# EAGLE schematic MXRDist+ (EAGLE 6.4)
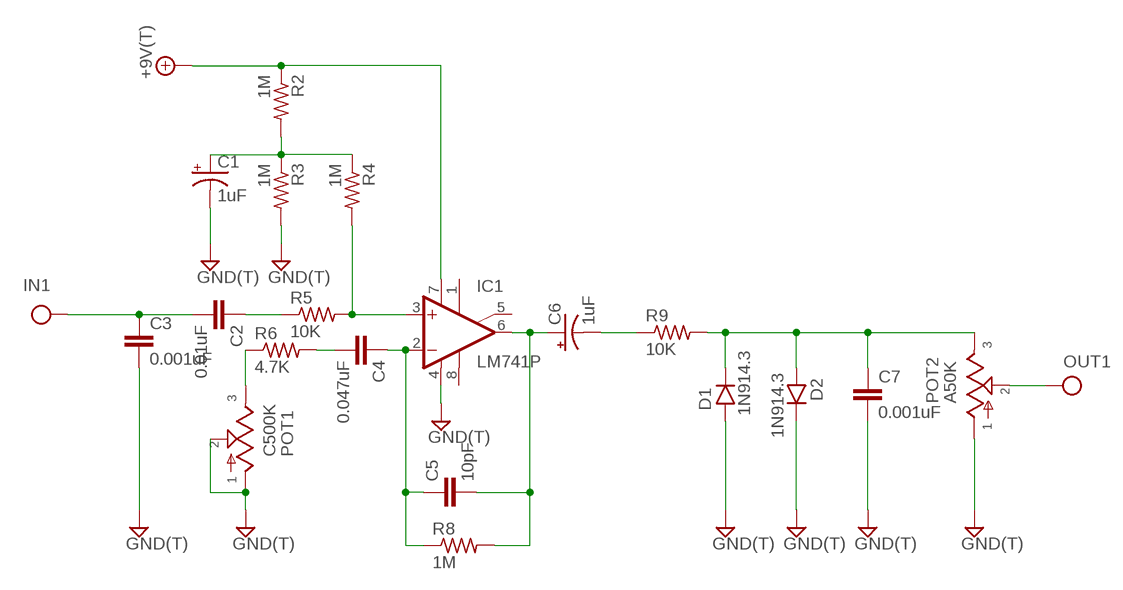
[diagram p0: schematic, sheet 1]

## Parts
+9V1  +9V(T)  [SQUARE]
C1  1uF  044A1  [044A]
C2  0.01uF  070X0302  [070X030]
C3  0.001uF  070X0302  [070X030]
C4  0.047uF  075X0402  [075X040]
C5  10pF  050X030_0251  [050X030_025]
C6  1uF  044A1  [044A]
C7  0.001uF  070X0302  [070X030]
D1  1N914.3  [DO35-3]
D2  1N914.3  [DO35-3]
GND1  GND(T)  [SQUARE]
GND2  GND(T)  [SQUARE]
GND3  GND(T)  [SQUARE]
GND4  GND(T)  [SQUARE]
GND5  GND(T)  [SQUARE]
GND6  GND(T)  [SQUARE]
GND7  GND(T)  [SQUARE]
GND8  GND(T)  [SQUARE]
GND9  GND(T)  [SQUARE]
IC1  LM741P  [DIL08]
IN1  IN(T)  [SQUARE]
OUT1  OUT(T)  [SQUARE]
POT1  C500K  POT16MM  [16MM]
POT2  A50K  POT16MM  [16MM]
R2  1M  6MM.3  [R0207/3]
R3  1M  6MM.3  [R0207/3]
R4  1M  6MM.3  [R0207/3]
R5  10K  6MM.3  [R0207/3]
R6  4.7K  6MM.3  [R0207/3]
R8  1M  6MM.3  [R0207/3]
R9  10K  6MM.3  [R0207/3]

## Nets
+9V: +9V1.1(+9V) IC1.7(V+) R2.1
GND: C1.2(-) C3.2 C7.2 D1.A D2.C GND1.1(GND) GND2.1(GND) GND3.1(GND) GND4.1(GND) GND5.1(GND) GND6.1(GND) GND7.1(GND) GND8.1(GND) GND9.1(GND) IC1.4(V-) POT1.1 POT1.2 POT2.1 R3.2
IN: C2.2 C3.1 IN1.1(IN)
N$1: C1.1(+) R2.2 R3.1 R4.1
N$2: IC1.3(+IN) R4.2 R5.2
N$3: C2.1 R5.1
N$4: POT1.3 R6.1
N$5: C5.2 C6.1(+) IC1.6(OUT) R8.2
N$6: C4.2 R6.2
N$7: C4.1 C5.1 IC1.2(-IN) R8.1
N$8: C6.2(-) R9.1
N$9: C7.1 D1.C D2.A POT2.3 R9.2
OUT: OUT1.1(OUT) POT2.2
Unconnected: IC1.1(ON1) IC1.5(ON2) IC1.8(OPT)

## Library data of the parts
+9V1 = gm-supply:+9V(T): +9V Voltage Supply use this to hook up +9v throughout a schematic instead of running wire automatically labels the net "+9v" adds a hookup pad to the circuit board
C1 C6 = gm-caps-tant:044A: .1 - 1.5µF Vishay Sprague Tantalex Long/Short (Case Code A); 4.4mm; 0.1" lead spacing 35 WVDC
C2 C3 C7 = gm-caps-film-chicklet:070X030: 0.0001 - .01uF (100 - 10,000pF) Panasonic ECQ-B 7mm x 3mm 50 or 63V: 0.0001 - .01uF (100 - 10,000pF);
C4 = gm-caps-film-chicklet:075X040: 0.039 - 0.047uF Panasonic ECQ-B 7mm x 4mm 50V: 0.039 - 0.047uF;
C5 = gm-caps-ceramic:050X030_025: 47 - 120pF Xicon Ceramic Disc 2.5mm lead spacing
D1 D2 = gm-diodes:1N914: Fast Switching Diode DO-35 glass case a.k.a. 1N4148
GND1-GND9 = gm-supply:GND(T): Ground use this to hook up ground (GND) throughout a schematic instead of running wire automatically labels the net "GND" adds a hookup pad to the circuit board (you can use several)
IC1 = gm-ics:*741: OP AMP
IN1 = gm-supply:IN(T): Input obsolete: use Pad instead and label net shematic input label with circuit board terminal/pad generally used only once on a schematic (because this device labels the net "IN" in the same way as a voltage supply or ground net)
OUT1 = gm-supply:OUT(T): Output obsolete: use Pad instead and label net output label with circuit board terminal/pad usually appears only once on a schematic
POT1 POT2 = gm-pots:POT: Potentiometers the arrow indicates the clockwise motion of th wiper (lug 2) fully counter clockwise there is no resistance between lugs 1 and 2 fully clockwise the resistance between lugs 1 and 2 is the value of the pot
R2-R6 R8 R9 = gm-resistors:6MM: 6mm Resistors Leads spaced 1-6 holes apart for 0.1" perfboard. Suitable for 1/4 watt resistors.